# Altium schematic sheet Sheet1.SchDoc
size A4
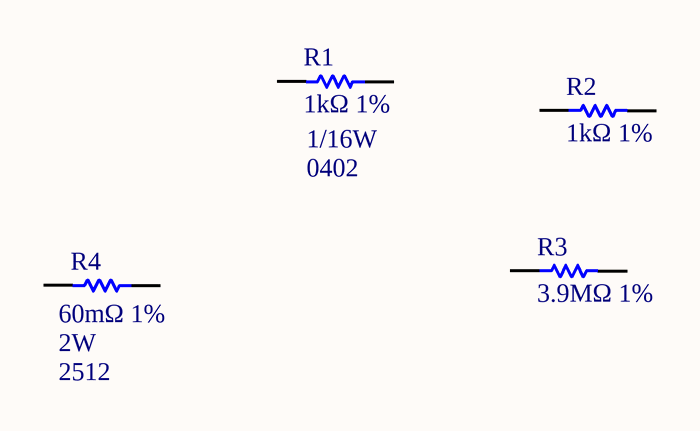
[diagram p0: Sheet1.SchDoc]

## Parts
R1  1kΩ 1%  Power: 1/16W  Case Code (for SMD): 0402  [RESC1005X04N]
R2  1kΩ 1%  [RESC1005X04N]
R3  3.9MΩ 1%  [RESC3016X06N]
R4  60mΩ 1%  Power: 2W  Case Code (for SMD): 2512  [RESC6432X10N]

## Nets

Not connected (* = marked no-connect by the designer): R1 1 2; R2 1 2; R3 1 2; R4 1 2

## Library data of the parts
R1 R2 = RES0000018: Film Resistor, 0402, 1kΩ, 1%,  1/16W; Manufacturer: YAGEO; Manufacturer Part Number: RC0402FR-071KL; Number: 193500369; Power Rating (WC): 0.0625 W; Name: Film Resistor, 0402 SIZE, 1kR, 1%, 1/16; Voltage Rating: 50 V; UNIQUEID: RES0000018; Value: 1kΩ 1%; Datasheet (Manufacturer LINK): https://www.yageo.com/upload/media/product/productsearch/datasheet/rchip/PYu-RC_Group_51_RoHS_L_11.pdf; Datasheet (Windchill LINK): https://windchill.embraco.com/Windchill/app/#ptc1/tcomp/infoPage?ContainerOid=OR%3Awt.inf.library.WTLibrary%3A400340347&oid=VR%3Awt.doc.WTDocument%3A1004142051&u8=1; Length (mm): 1; Width (mm): 0.5; Height (mm): 0.35; Maximum Operating Temperature: 155 degC; Mounting technology: SMT
  R2: Power: 1/16W; Case Code (for SMD): 0402
R3 = RES0000021: Film Resistor, 1206, 3.9MΩ, 1%, 1/4W; Manufacturer: Yageo; Manufacturer Part Number: RC1206FR-073M9L; Number: 193500507; Power: 1/16W; Power Rating (WC): 0.0625 W; Name: Film Resistor 1206 3M9 1% 1/4W; Voltage Rating: 200 V; UNIQUEID: RES0000021; Value: 3.9MΩ 1%; Case Code (for SMD): 1206; Datasheet (Windchill LINK): https://windchill.embraco.com/Windchill/app/#ptc1/tcomp/infoPage?ContainerOid=OR%3Awt.inf.library.WTLibrary%3A400340347&oid=VR%3Awt.doc.WTDocument%3A524289079&u8=1; Length (mm): 3.1; Width (mm): 1.6; Height (mm): 0.55; Maximum Operating Temperature: 155 degC; Mounting technology: SMT
R4 = RES0000026: Shunt Resistor, 2512, 60mΩ, 1%, 2W; Manufacturer: YAGEO; Manufacturer Part Number: PE2512FKF7W0R06L; Number: 193500525; Name: 2512 60 mΩ shunt resistor 1% 2W 155 °C; UNIQUEID: RES0000026; Value: 60mΩ 1%; Power Rating (WC): 2 W; Datasheet (Manufacturer LINK): https://www.yageo.com/upload/media/product/products/datasheet/rchip/PYu-PE_521_RoHS_L_10.pdf; Datasheet (Windchill LINK): https://windchill.embraco.com/Windchill/app/#ptc1/tcomp/infoPage?oid=VR%3Awt.doc.WTDocument%3A1076267713; Length (mm): 6.35; Width (mm): 3.18; Height (mm): 0.54; Maximum Operating Temperature: 170 degC; Minimum Operating Temperature: -55 degC; Mounting technology: SMT